# Altium project LCD驱动板.PrjPcb
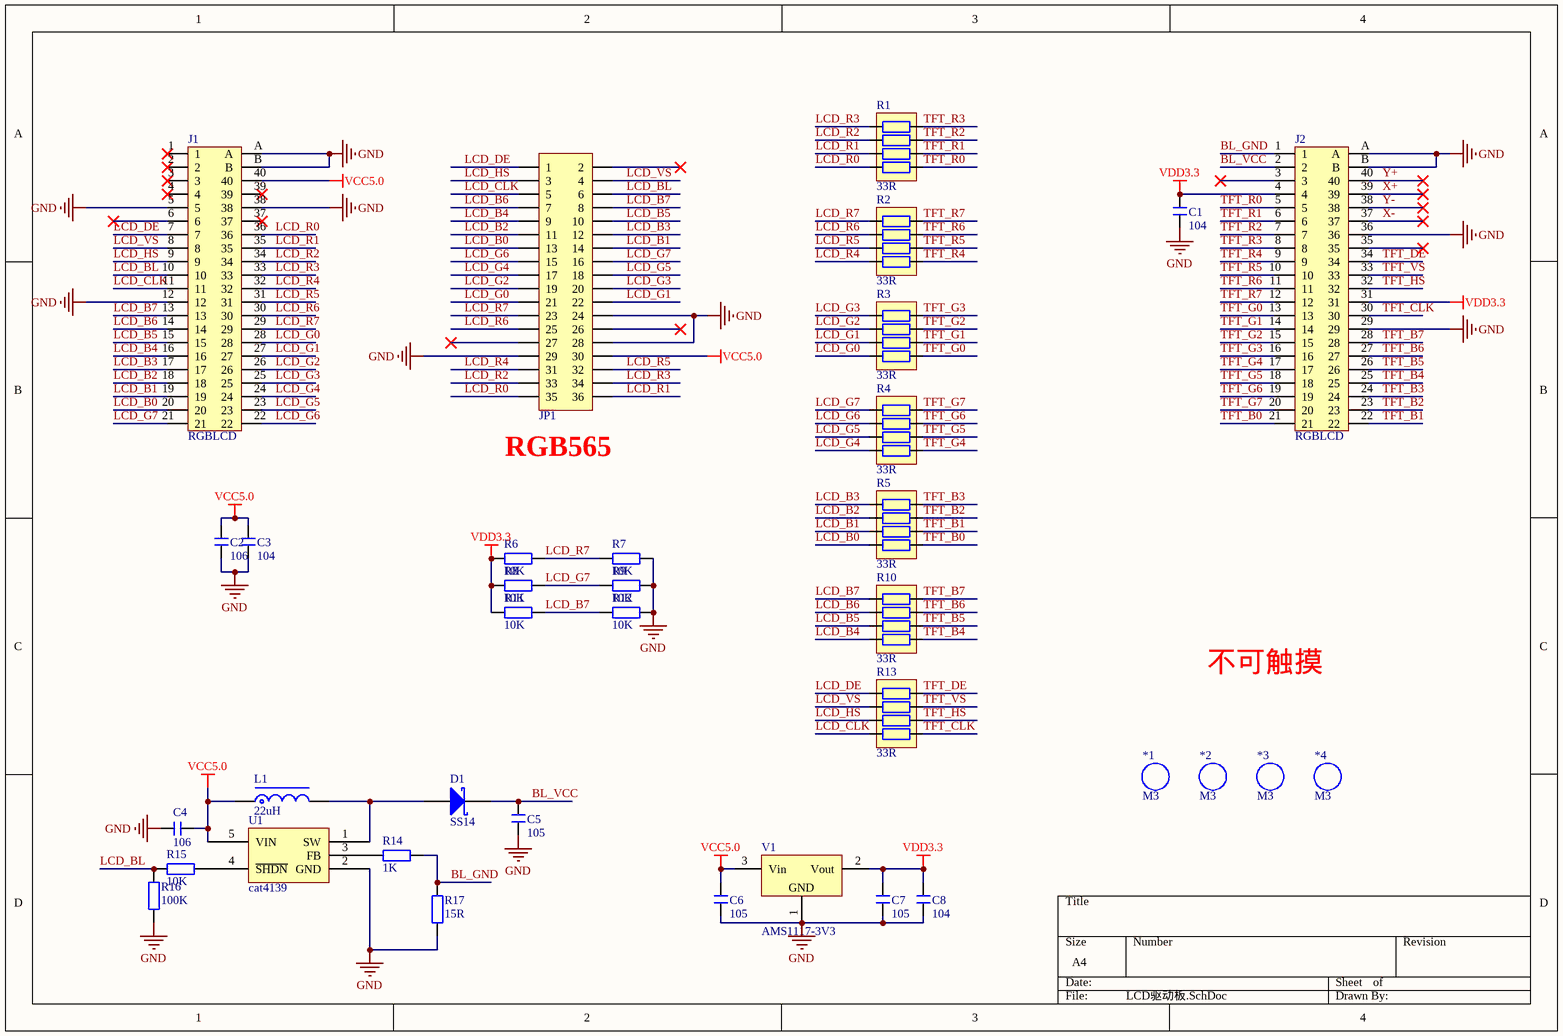
[diagram p0: LCD驱动板.SchDoc]
1 sheet, 36 parts. Net scope: global (net labels, ports and power ports of the same name join across sheets).
Board file: LCD驱动板.PcbDoc

## Sheet LCD驱动板.SchDoc
size A4

### Parts
*1  M3  [M3 125X200]
*2  M3  [M3 125X200]
*3  M3  [M3 125X200]
*4  M3  [M3 125X200]
C1  104  [C 0603_L]
C2  106  [C 0805_L]
C3  104  [C 0603_L]
C4  106  [C 0805_L]
C5  105  [C 0805_L]
C6  105  [C 0805_L]
C7  105  [C 0805_L]
C8  104  [C 0603_L]
D1  SS14  [SMA]
J1  RGBLCD  [FPC-TOP40]
J2  RGBLCD  [FPC-TOP40]
JP1  Header 2X11  [HDR2.54-LI-2x18P]  (value not drawn)
L1  22uH  [NR5020]
R1  33R  [RCA-8P4R-0402]
R2  33R  [RCA-8P4R-0402]
R3  33R  [RCA-8P4R-0402]
R4  33R  [RCA-8P4R-0402]
R5  33R  [RCA-8P4R-0402]
R6  10K  [R 0603_L]
R7  10K  [R 0603_L]
R8  10K  [R 0603_L]
R9  10K  [R 0603_L]
R10  33R  [RCA-8P4R-0402]
R11  10K  [R 0603_L]
R12  10K  [R 0603_L]
R13  33R  [RCA-8P4R-0402]
R14  1K  [R 0603_L]
R15  10K  [R 0603_L]
R16  100K  [R 0603_L]
R17  15R  [R 0603_L]
U1  cat4139  [SOT23-5]
V1  AMS1117-3V3  [SOT223_L]

### Nets
GND: C1.1 C2.2 C3.1 C4.1 C5.1 C6.1 C7.1 C8.1 J1.5 J1.12 J1.38 J1.A J1.B J2.29 J2.36 J2.A J2.B JP1.24 JP1.28 JP1.29 R7.2 R9.2 R12.2 R16.1 R17.1 U1.2(GND) V1.1(GND)
VCC5.0: C2.1 C3.2 C4.2 C6.2 J1.40 JP1.30 L1.1 U1.5(VIN) V1.3(Vin)
VDD3.3: C1.2 C7.2 C8.2 J2.4 J2.31 R6.1 R8.1 R11.1 V1.2(Vout)
BL_GND: J2.1 R14.2 R17.2
BL_VCC: C5.2 D1.2(K) J2.2
LCD_B0: J1.20 JP1.13 R5.1
LCD_B1: J1.19 JP1.14 R5.2
LCD_B2: J1.18 JP1.11 R5.3
LCD_B3: J1.17 JP1.12 R5.4
LCD_B4: J1.16 JP1.9 R10.1
LCD_B5: J1.15 JP1.10 R10.2
LCD_B6: J1.14 JP1.7 R10.3
LCD_B7: J1.13 JP1.8 R10.4 R11.2 R12.1
LCD_BL: J1.10 JP1.6 R15.1 R16.2
LCD_CLK: J1.11 JP1.5 R13.1
LCD_DE: J1.7 JP1.1 R13.4
LCD_G0: J1.28 JP1.21 R3.1
LCD_G1: J1.27 JP1.22 R3.2
LCD_G2: J1.26 JP1.19 R3.3
LCD_G3: J1.25 JP1.20 R3.4
LCD_G4: J1.24 JP1.17 R4.1
LCD_G5: J1.23 JP1.18 R4.2
LCD_G6: J1.22 JP1.15 R4.3
LCD_G7: J1.21 JP1.16 R4.4 R8.2 R9.1
LCD_HS: J1.9 JP1.3 R13.2
LCD_R0: J1.36 JP1.35 R1.1
LCD_R1: J1.35 JP1.36 R1.2
LCD_R2: J1.34 JP1.33 R1.3
LCD_R3: J1.33 JP1.34 R1.4
LCD_R4: J1.32 JP1.31 R2.1
LCD_R5: J1.31 JP1.32 R2.2
LCD_R6: J1.30 JP1.25 R2.3
LCD_R7: J1.29 JP1.23 R2.4 R6.2 R7.1
LCD_VS: J1.8 JP1.4 R13.3
TFT_B0: J2.21 R5.8
TFT_B1: J2.22 R5.7
TFT_B2: J2.23 R5.6
TFT_B3: J2.24 R5.5
TFT_B4: J2.25 R10.8
TFT_B5: J2.26 R10.7
TFT_B6: J2.27 R10.6
TFT_B7: J2.28 R10.5
TFT_CLK: J2.30 R13.8
TFT_DE: J2.34 R13.5
TFT_G0: J2.13 R3.8
TFT_G1: J2.14 R3.7
TFT_G2: J2.15 R3.6
TFT_G3: J2.16 R3.5
TFT_G4: J2.17 R4.8
TFT_G5: J2.18 R4.7
TFT_G6: J2.19 R4.6
TFT_G7: J2.20 R4.5
TFT_HS: J2.32 R13.7
TFT_R0: J2.5 R1.8
TFT_R1: J2.6 R1.7
TFT_R2: J2.7 R1.6
TFT_R3: J2.8 R1.5
TFT_R4: J2.9 R2.8
TFT_R5: J2.10 R2.7
TFT_R6: J2.11 R2.6
TFT_R7: J2.12 R2.5
TFT_VS: J2.33 R13.6
X+: J2.39
X-: J2.37
Y+: J2.40
Y-: J2.38
NetD1_1: D1.1(A) L1.2 U1.1(SW)
NetR14_1: R14.1 U1.3(FB)
NetR15_2: R15.2 U1.4(~{SHDN})

Not connected (* = marked no-connect by the designer): J1 1* 2* 3* 4* 6* 37* 39*; J2 3* 35*; JP1 2* 26* 27*

### Notes on the sheet
- (near JP1) RGB565
- 不可触摸

### Library data of the parts
*1-*4 = M3: 铜柱孔; 版权归属: 封装库来自淘宝 ID：黄晶宝石; BOM名称: 铜柱孔; 学习资源: https://shop463601444.taobao.com
C1-C8 = C: 贴片电容; BOM名称: 无极性贴片电容; 淘宝ID: 封装库来自淘宝 ID：黄晶宝石; 联系售后: https://shop463601444.taobao.com
D1 = SS14: 肖特基二极管; 属性: 40V/1A; BOM名称: 肖特基二极管; 封装库来自淘宝 ID：黄晶宝石: https://shop463601444.taobao.com
J1 J2 = FPC-40: FPC-40P-0.5mm
JP1 = Header 18X2: 18*2P接插件; 版权归属: 封装库来自淘宝 ID：黄晶宝石; BOM名称: 18*2P接插件; 学习资源: https://shop463601444.taobao.com
L1 = L-NR: NR磁胶电感; 版权归属: 来自淘宝 ID：黄晶宝石; BOM名称: NR磁胶电感; 联系售后: https://shop463601444.taobao.com
R1-R5 R10 R13 = R-8P4R: 贴片排阻; BOM名称: 贴片网络排阻; 版权归属: 封装库来自淘宝 ID：黄晶宝石; 联系售后: https://shop463601444.taobao.com
R6-R9 R11 R12 R14-R17 = R: 贴片电阻; 版权归属: 来自淘宝 ID：黄晶宝石; BOM名称: 贴片电阻; 联系售后: https://shop463601444.taobao.com
V1 = AMS1117: 三端稳压芯片; BOM名称: 稳压芯片; 淘宝ID: 封装库来自淘宝 ID：黄晶宝石; 欢迎光临淘宝店铺: https://shop463601444.taobao.com